# Altium schematic sheet Sheet2.SchDoc
size A4; SheetNumber: 2; SheetTotal: 2
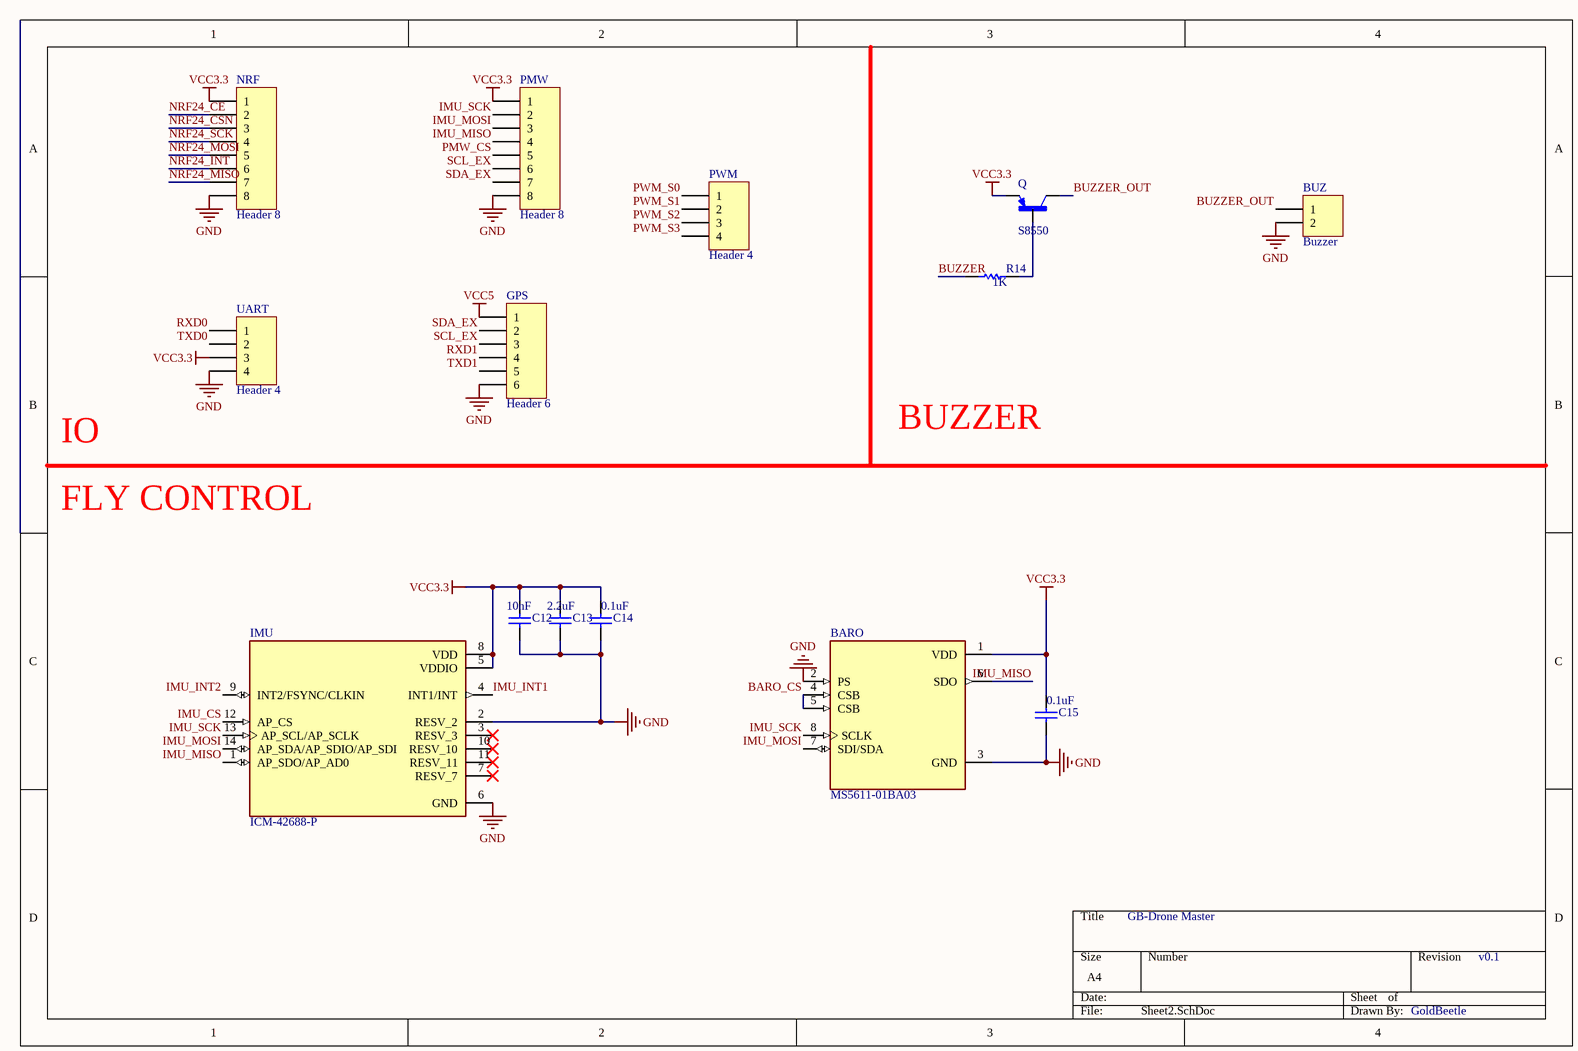
[diagram p0: Sheet2.SchDoc]

## Parts
BARO  MS5611-01BA03  [MS5611-SON125P500X300X100-8N]
BUZ  Buzzer  [POWER-2P]
C12  value 10nF  [C0805]  (hidden comment: 0.1uF/50V(10%))
C13  value 2.2uF  [C0805]  (hidden comment: 10uF/25v(20%))
C14  value 0.1uF  [C0805]  (hidden comment: 0.1uF/50V(10%))
C15  value 0.1uF  [C0805]  (hidden comment: 0.1uF/50V(10%))
GPS  Header 6  [SIGNAL-6P]
IMU  ICM-42688-P  [ICM42688-PQFN50P300X250X97-14N]
NRF  Header 8  [SIGNAL-8P]
PMW  Header 8  [SIGNAL-8P]
PWM  Header 4  [SIGNAL-4P]
Q  S8550  [SOT-23_S8550]
R14  1K  [C0805]
UART  Header 4  [HDR2X2]

## Nets
GND: BARO.2(PS) BARO.3(GND) BUZ.2 C12.2 C13.1 C14.2 C15.2 GPS.6 IMU.2(RESV_2) IMU.6(GND) NRF.8 PMW.8 UART.4
VCC3.3: BARO.1(VDD) C12.1 C13.2 C14.1 C15.1 IMU.5(VDDIO) IMU.8(VDD) NRF.1 PMW.1 Q.2(E) UART.3
VCC5: GPS.1
BARO_CS: BARO.4(CSB) BARO.5(CSB)
BUZZER: R14.1
BUZZER_OUT: BUZ.1 Q.3(C)
IMU_CS: IMU.12(AP_CS)
IMU_INT1: IMU.4(INT1/INT)
IMU_INT2: IMU.9(INT2/FSYNC/CLKIN)
IMU_MISO: BARO.6(SDO) IMU.1(AP_SDO/AP_AD0) PMW.4
IMU_MOSI: BARO.7(SDI/SDA) IMU.14(AP_SDA/AP_SDIO/AP_SDI) PMW.3
IMU_SCK: BARO.8(SCLK) IMU.13(AP_SCL/AP_SCLK) PMW.2
NRF24_CE: NRF.2
NRF24_CSN: NRF.3
NRF24_INT: NRF.6
NRF24_MISO: NRF.7
NRF24_MOSI: NRF.5
NRF24_SCK: NRF.4
PMW_CS: PMW.5
PWM_S0: PWM.1
PWM_S1: PWM.2
PWM_S2: PWM.3
PWM_S3: PWM.4
RXD0: UART.1
RXD1: GPS.4
SCL_EX: GPS.3 PMW.6
SDA_EX: GPS.2 PMW.7
TXD0: UART.2
TXD1: GPS.5
NetQ_1: Q.1(B) R14.2

Not connected (* = marked no-connect by the designer): IMU 3(RESV_3)* 7(RESV_7)* 10(RESV_10)* 11(RESV_11)*

## Notes on the sheet
- IO
- BUZZER
- FLY CONTROL
- GB-Drone Master
- v0.1
- GoldBeetle

## Library data of the parts
BARO = MS5611-01BA03: Pressure Sensor 0.15PSI ~ 17.4PSI (1kPa ~ 120kPa) Absolute - 24 b 8-SMD; MF: TE Connectivity; Package: SMD-8 Measurement Specialties; Price: None; Value: *; SnapEDA_Link: https://www.snapeda.com/parts/MS5611-01BA03/TE+Connectivity+ALCOSWITCH+Switches/view-part/?ref=snap; MP: MS5611-01BA03; Availability: Not in stock; Check_prices: https://www.snapeda.com/parts/MS5611-01BA03/TE+Connectivity+ALCOSWITCH+Switches/view-part/?ref=eda
BUZ = Header 2: Header, 2-Pin; LatestRevisionDate: 17-Jul-2002; LatestRevisionNote: Re-released for DXP Platform.; Publisher: Altium Limited
C12-C15 = Cap: Capacitor; Published: 8-Jun-2000; LatestRevisionDate: 17-Jul-2002; LatestRevisionNote: Re-released for DXP Platform.; PackageReference: RAD-0.3; Publisher: Altium Limited; PackageDescription: Radial Cap, Thru-Hole; 2 Leads; 0.3 in Pin Spacing
GPS = Header 6: Header, 6-Pin; LatestRevisionDate: 17-Jul-2002; LatestRevisionNote: Re-released for DXP Platform.; Publisher: Altium Limited
IMU = ICM-42688-P: Accelerometer, Gyroscope, 6 Axis Sensor Output; Package: None; MP: ICM-42688-P; Value: *; Availability: Unavailable; Price: None
NRF PMW = Header 8: Header, 8-Pin; LatestRevisionDate: 17-Jul-2002; LatestRevisionNote: Re-released for DXP Platform.; Publisher: Altium Limited
PWM UART = Header 4: Header, 4-Pin; LatestRevisionDate: 17-Jul-2002; LatestRevisionNote: Re-released for DXP Platform.; Publisher: Altium Limited
Q = S8550: Bipolar (BJT) Transistor PNP 25 V 500 mA 150MHz 300 mW Surface Mount SOT-23; MF: MDD; SnapEDA_Link: https://www.snapeda.com/parts/S8550/MDD/view-part/?ref=snap; Package: SOT-23 MDD; Value: *; MP: S8550; Check_prices: https://www.snapeda.com/parts/S8550/MDD/view-part/?ref=eda
R14 = Res1: Resistor; Published: 8-Jun-2000; LatestRevisionDate: 17-Jul-2002; LatestRevisionNote: Re-released for DXP Platform.; PackageReference: AXIAL-0.3; Publisher: Altium Limited; PackageDescription: Axial Device, Thru-Hole; 2 Leads; 0.3 in Pin Spacing